# EAGLE design STM32F030F4 (EAGLE 8.0.1)
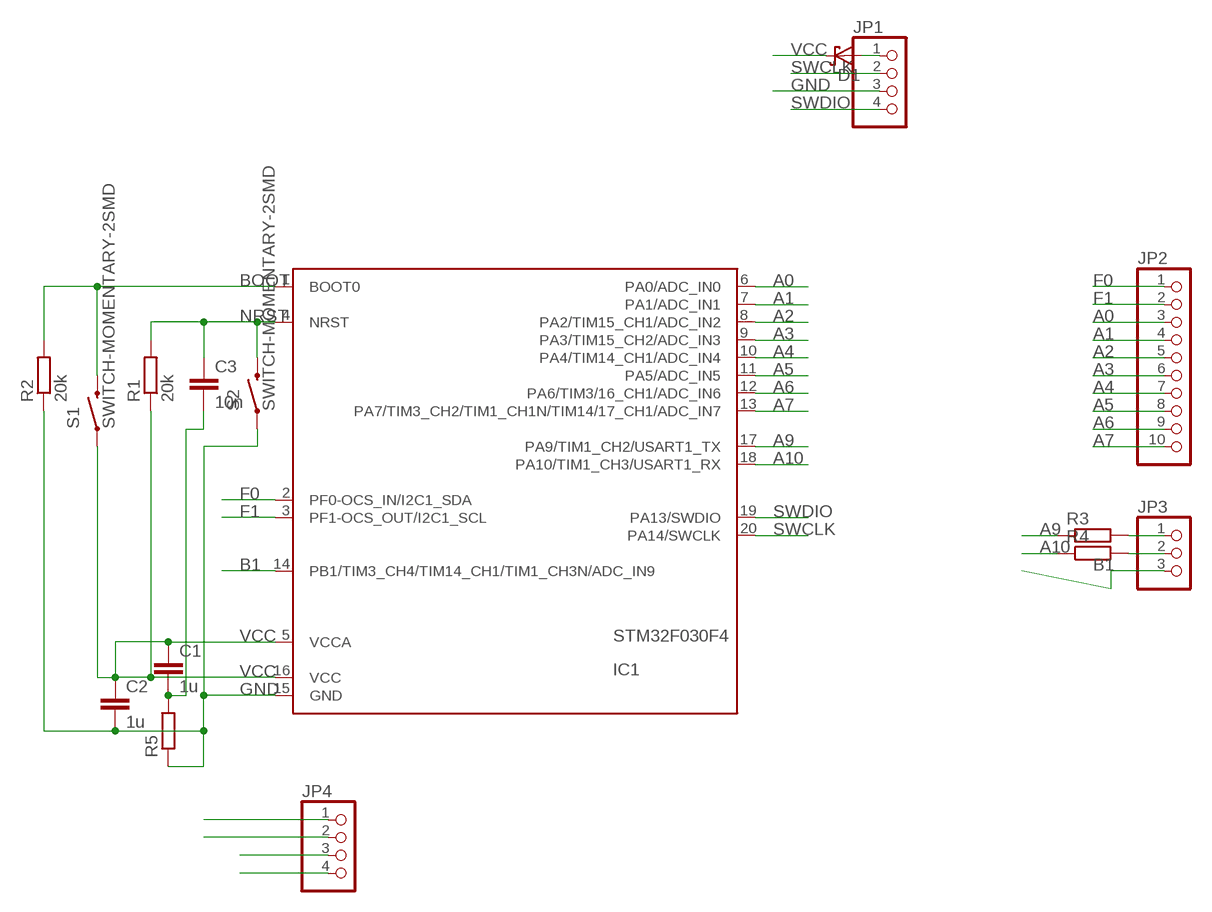
[diagram p0: schematic, sheet 1]

## Parts
C1  1u  CAP_1206  [C1206]
C2  1u  CAP_1206  [C1206]
C3  10n  CAP_1206  [C1206]
D1  DIODE-SH_SOD523  [SOD523]
IC1  STM32F030F4  [TSSOP20]
JP1  PINHD-1X4  [1X04]
JP2  PINHD-1X10  [1X10]
JP3  PINHD-1X3  [1X03]
JP4  PINHD-1X4  [1X04]
R1  20k  R_1206  [R1206]
R2  20k  R_1206  [R1206]
R3  R_1206  [R1206]
R4  R_1206  [R1206]
R5  R_1206  [R1206]
S1  SWITCH-MOMENTARY-2SMD  [TACTILE-SWITCH-SMD]
S2  SWITCH-MOMENTARY-2SMD  [TACTILE-SWITCH-SMD]

## Nets
A0: IC1.6(PA0/ADC_IN0) JP2.3
A1: IC1.7(PA1/ADC_IN1) JP2.4
A2: IC1.8(PA2/TIM15_CH1/ADC_IN2) JP2.5
A3: IC1.9(PA3/TIM15_CH2/ADC_IN3) JP2.6
A4: IC1.10(PA4/TIM14_CH1/ADC_IN4) JP2.7
A5: IC1.11(PA5/ADC_IN5) JP2.8
A6: IC1.12(PA6/TIM3/16_CH1/ADC_IN6) JP2.9
A7: IC1.13(PA7/TIM3_CH2/TIM1_CH1N/TIM14/17_CH1/ADC_IN7) JP2.10
A9: IC1.17(PA9/TIM1_CH2/USART1_TX) R3.1
A10: IC1.18(PA10/TIM1_CH3/USART1_RX) R4.1
B1: IC1.14(PB1/TIM3_CH4/TIM14_CH1/TIM1_CH3N/ADC_IN9) JP3.3
BOOT: IC1.1(BOOT0) R2.2 S1.3
F0: IC1.2(PF0-OCS_IN/I2C1_SDA) JP2.1
F1: IC1.3(PF1-OCS_OUT/I2C1_SCL) JP2.2
GND: C2.2 IC1.15(GND) JP1.3 JP4.3 JP4.4 R2.1 R5.1 S2.1
N$1: D1.A JP1.1
N$2: JP3.1 R3.2
N$3: JP3.2 R4.2
N$4: C1.2 C3.2 R5.2
NRST: C3.1 IC1.4(NRST) R1.2 S2.3
SWCLK: IC1.20(PA14/SWCLK) JP1.2
SWDIO: IC1.19(PA13/SWDIO) JP1.4
VCC: C1.1 C2.1 D1.C IC1.5(VCCA) IC1.16(VCC) JP4.1 JP4.2 R1.1 S1.1

## Library data of the parts
C1-C3 = Namenlos:CAP_
D1 = Namenlos:DIODE-SH_
IC1 = Namenlos:STM32F030F4
JP1 JP4 = pinhead:PINHD-1X4: PIN HEADER
JP2 = pinhead:PINHD-1X10: PIN HEADER
JP3 = pinhead:PINHD-1X3: PIN HEADER
R1-R5 = Namenlos:R_
S1 S2 = SparkFun-Electromechanical:SWITCH-MOMENTARY-2: Various NO switches- pushbuttons, reed, etc; PROD_ID: SWCH-08247

## Board
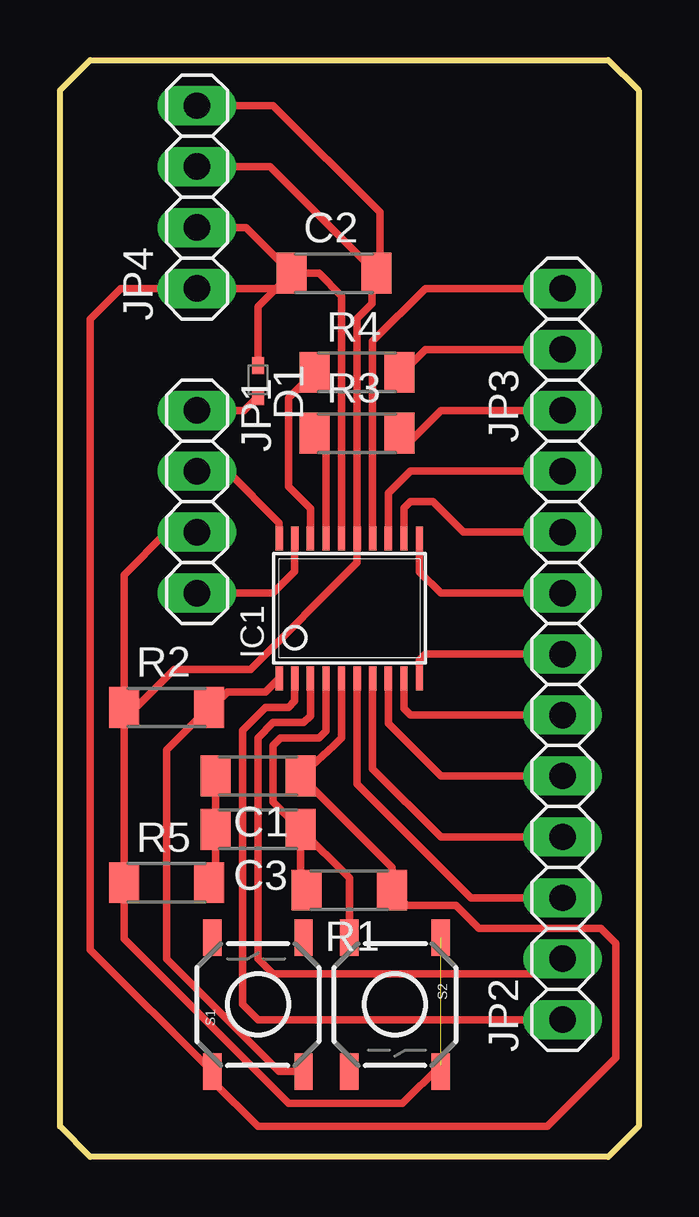
[diagram p1: board, top side]

Size 24.13 x 45.72 mm. Coordinates in mm from the lower left corner, seen from the top.
Outline: 24.13,1.27 22.86,0 1.27,0 0,1.27 0,44.45 1.27,45.72 22.86,45.72 24.13,44.45 24.13,1.27
Copper layers (1*16): Top 0.035mm / dielectric 1.5mm / Bottom 0.035mm
Design rules "EagleDesignRules": minimum track width 0.2mm, minimum drill 0.3mm, track to track 0.2mm, track to pad 0.2mm, pad to pad 0.2mm, via to via 0.2mm, smd to smd 0.2mm, copper to edge 1mm, drill to drill 0.2mm, minimum pad ring 10mil, minimum via ring 8mil, stop-mask expansion 4mil, vias tented up to drill 0mil, thermal gap 0.25mm

### Footprints (pad centres in the part's own frame; a part is rotated, then mirrored left to right if it is on the bottom)
C1206 = smd 1.25 x 1.7: 1 -1.775,0; 2 1.775,0
SOD523 = smd 0.7 x 0.5: A 0.7,0; C -0.6,0
TSSOP20 = smd 0.305 x 0.991: 1 -2.925,-2.918; 2 -2.275,-2.918; 3 -1.625,-2.918; 4 -0.975,-2.918; 5 -0.325,-2.918; 6 0.325,-2.918; 7 0.975,-2.918; 8 1.625,-2.918; 9 2.275,-2.918; 10 2.925,-2.918; 11 2.925,2.918; 12 2.275,2.918; 13 1.625,2.918; 14 0.975,2.918; 15 0.325,2.918; 16 -0.325,2.918; 17 -0.975,2.918; 18 -1.625,2.918; 19 -2.275,2.918; 20 -2.925,2.918
1X04 = drill 1.1 long: 1 -3.81,0; 2 -1.27,0; 3 1.27,0; 4 3.81,0
1X10 = drill 1.1 long: 1 -11.43,0; 2 -8.89,0; 3 -6.35,0; 4 -3.81,0; 5 -1.27,0; 6 1.27,0; 7 3.81,0; 8 6.35,0; 9 8.89,0; 10 11.43,0
1X03 = drill 1.1 long: 1 -2.54,0; 2 0,0; 3 2.54,0
R1206 = smd 1.25 x 1.7: 1 -1.775,0; 2 1.775,0
TACTILE-SWITCH-SMD = smd 1.524 x 0.762: 1 -2.794,1.905; 2 2.794,1.905; 3 -2.794,-1.905; 4 2.794,-1.905

### Placement (x,y rotation side)
C1  8.26,15.88 180 top
C2  11.43,36.83 0 top
C3  8.26,13.65 180 top
D1  8.26,32.39 270 top
IC1  12.06,22.86 0 top
JP1  5.72,27.31 270 top
JP2  20.95,17.14 90 top
JP3  20.95,33.66 90 top
JP4  5.72,40 90 top
R1  12.06,11.11 180 top
R2  4.45,18.73 0 top
R3  12.38,30.16 0 top
R4  12.38,32.7 0 top
R5  4.45,11.43 0 top
S1  8.26,6.35 90 top
S2  13.97,6.35 270 top

### Tracks (layer width: path | path; a pad name or v marks a point on that pad's centre or on a via)
A0
  Top 0.305: IC1.6 12.39,15.55 17.14,10.8 JP2.3
A1
  Top 0.305: IC1.7 13.04,16.17 15.88,13.34 JP2.4
A2
  Top 0.305: IC1.8 13.69,18.06 15.88,15.88 JP2.5
A3
  Top 0.305: IC1.9 14.34,18.68 14.6,18.41 JP2.6
A4
  Top 0.305: IC1.10 14.99,20.71 15.24,20.96 JP2.7
A5
  Top 0.305: IC1.11 14.99,24.38 15.88,23.5 JP2.8
A6
  Top 0.305: IC1.12 14.34,27.04 14.6,27.31 15.56,27.31 16.83,26.04 JP2.9
A7
  Top 0.305: IC1.13 13.69,27.66 14.6,28.57 JP2.10
A9
  Top 0.305: IC1.17 11.09,29.36 R3.1
A10
  Top 0.305: IC1.18 10.44,27.03 9.52,27.94 9.52,31.62 R4.1
B1
  Top 0.305: IC1.14 13.04,34 15.24,36.19 JP3.3
BOOT
  Top 0.305: 9.14,19.75 IC1.1 8.56,19.37 6.98,19.37 6.35,18.73 R2.2 4.45,16.96 4.45,8.26 9.14,3.56 S1.3
F0
  Top 0.305: JP2.1 8.26,5.71 7.62,6.35 7.62,17.78 8.57,18.73 9.52,18.73 9.79,19 IC1.2
F1
  Top 0.305: JP2.2 20.32,7.62 8.89,7.62 8.26,8.26 8.26,17.46 8.89,18.1 10.16,18.1 10.44,18.38 IC1.3
GND  (1 unrouted)
  Top 0.305: 4.45,26.04 4.13,25.72 | 4.45,26.04 JP1.3 | R2.1 R5.1 2.67,9.08 9.52,2.22 14.29,2.22 15.88,3.81 | C2.2 13.02,36.83 13.02,35.56 12.39,34.93 IC1.15 12.39,24.77 7.94,20.32 4.76,20.32 3.17,18.73 R2.1 | R2.1 2.67,24.26 4.45,26.04 | JP4.3 8.76,41.28 C2.2 | JP4.4 8.89,43.81 13.34,39.37 13.34,36.96 C2.2
N$1
  Top 0.305: JP1.1 7.69,31.11 D1.A
N$2
  Top 0.305: R3.2 14.6,29.85 15.88,31.11 JP3.1
N$3
  Top 0.305: R4.2 14.16,32.57 15.24,33.66 JP3.2
N$4
  Top 0.305: R5.2 6.48,11.69 C3.2 C1.2
NRST
  Top 0.305: S2.3 12.06,11.62 C3.1 | C3.1 10.03,11.37 R1.2 | C3.1 8.89,14.79 8.89,17.14 9.21,17.46 10.8,17.46 11.09,17.76 IC1.4
SWCLK
  Top 0.305: IC1.20 9.14,26.42 6.98,28.57 JP1.2
SWDIO
  Top 0.305: IC1.19 9.79,24.39 8.89,23.5 JP1.4
VCC
  Top 0.305: IC1.5 11.74,17.46 11.43,17.14 C1.1 13.84,12.07 R1.1 14.48,10.48 16.51,10.48 17.46,9.53 22.54,9.53 23.18,8.89 23.18,4.13 20.32,1.27 8.26,1.27 6.35,3.18 S1.1 1.27,8.64 1.27,34.92 2.54,36.19 JP4.1 9.02,36.19 C2.1 | C2.1 8.26,35.43 D1.C | IC1.16 11.74,35.89 10.8,36.83 C2.1 | JP4.2 7.75,38.73 C2.1